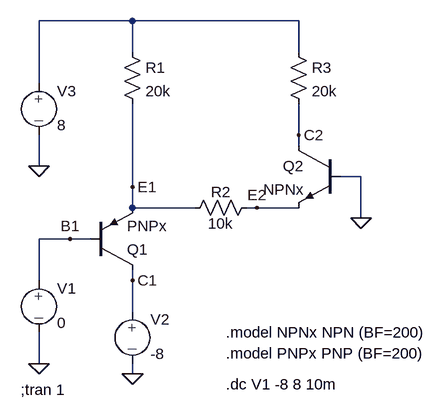
[diagram p0: schematic Klausur_11.1.asc]
Klausur_11.1.asc, the LTspice schematic file:
Version 4
SHEET 1 880 680
WIRE 48 -64 -96 -64
WIRE 304 -64 48 -64
WIRE 48 -16 48 -64
WIRE 304 -16 304 -64
WIRE -96 32 -96 -64
WIRE 304 112 304 64
WIRE 304 128 304 112
WIRE -96 160 -96 112
WIRE 400 176 368 176
WIRE 48 192 48 64
WIRE 48 224 48 192
WIRE 144 224 48 224
WIRE 240 224 224 224
WIRE 304 224 240 224
WIRE 400 240 400 176
WIRE -48 272 -96 272
WIRE -16 272 -48 272
WIRE -96 336 -96 272
WIRE 48 336 48 320
WIRE 48 384 48 336
WIRE -96 464 -96 416
WIRE 48 480 48 464
FLAG -96 464 0
FLAG 48 480 0
FLAG 400 240 0
FLAG -96 160 0
FLAG 304 112 C2
FLAG 48 336 C1
FLAG 48 192 E1
FLAG 240 224 E2
FLAG -48 272 B1
SYMBOL EIT_Semiconductors\\npn 368 128 M0
SYMATTR InstName Q2
SYMATTR Value NPNx
SYMBOL EIT_Semiconductors\\pnp -16 320 M180
SYMATTR InstName Q1
SYMATTR Value PNPx
SYMBOL res 240 208 R90
WINDOW 0 7 56 VBottom 0
WINDOW 3 25 56 VTop 0
SYMATTR InstName R2
SYMATTR Value 10k
SYMBOL res 32 -32 R0
SYMATTR InstName R1
SYMATTR Value 20k
SYMBOL res 288 -32 R0
SYMATTR InstName R3
SYMATTR Value 20k
SYMBOL source-V -96 320 R0
WINDOW 123 0 0 Left 0
WINDOW 39 0 0 Left 0
SYMATTR InstName V1
SYMATTR Value 0
SYMBOL source-V 48 368 R0
WINDOW 123 0 0 Left 0
WINDOW 39 0 0 Left 0
SYMATTR InstName V2
SYMATTR Value -8
SYMBOL source-V -96 16 R0
WINDOW 123 0 0 Left 0
WINDOW 39 0 0 Left 0
SYMATTR InstName V3
SYMATTR Value 8
TEXT 192 416 Left 0 !.model NPNx NPN (BF=200)
TEXT 192 448 Left 0 !.model PNPx PNP (BF=200)
TEXT -124 504 Left 0 !;tran 1
TEXT 192 496 Left 0 !.dc V1 -8 8 10m

The netlist it stands for:
* Klausur_11.1.asc
Q2 C2 0 E2 0 NPNx
Q1 C1 B1 E1 0 PNPx
R2 E2 E1 10k
R1 N001 E1 20k
R3 N001 C2 20k
V1 B1 0 0
V2 C1 0 -8
V3 N001 0 8
.model NPN NPN
.model PNP PNP
.lib standard.bjt
.model NPNx NPN (BF=200)
.model PNPx PNP (BF=200)
;tran 1
.dc V1 -8 8 10m
.backanno
.end